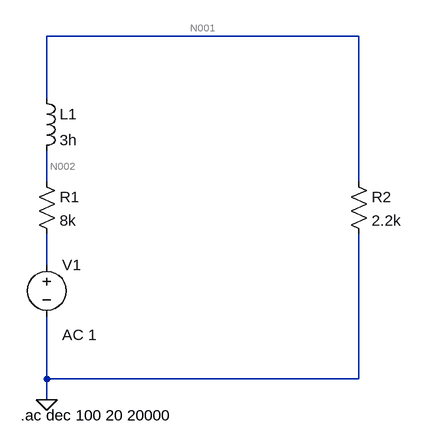
[diagram p0: schematic Direct.asc]
Direct.asc, the LTspice schematic file:
Version 4.1
SHEET 1 880 680
WIRE 608 -208 128 -208
WIRE 128 -112 128 -208
WIRE 128 16 128 -32
WIRE 608 16 608 -208
WIRE 128 144 128 96
WIRE 128 320 128 224
WIRE 608 320 608 96
WIRE 608 320 128 320
WIRE 128 352 128 320
FLAG 128 352 0
SYMBOL voltage 128 128 R0
WINDOW 123 24 124 Left 2
WINDOW 39 0 0 Left 0
SYMATTR InstName V1
SYMATTR Value ""
SYMATTR Value2 AC 1
SYMBOL res 112 0 R0
SYMATTR InstName R1
SYMATTR Value 8k
SYMBOL ind 112 -128 R0
SYMATTR InstName L1
SYMATTR Value 3h
SYMBOL res 592 0 R0
SYMATTR InstName R2
SYMATTR Value 2.2k
TEXT 88 376 Left 2 !.ac dec 100 20 20000

The netlist it stands for:
* Direct.asc
V1 N003 0 AC 1
R1 N002 N003 8k
L1 N001 N002 3h
R2 N001 0 2.2k
.ac dec 100 20 20000
.backanno
.end

* Results of the author's LTspice run, read from the files saved beside the schematic
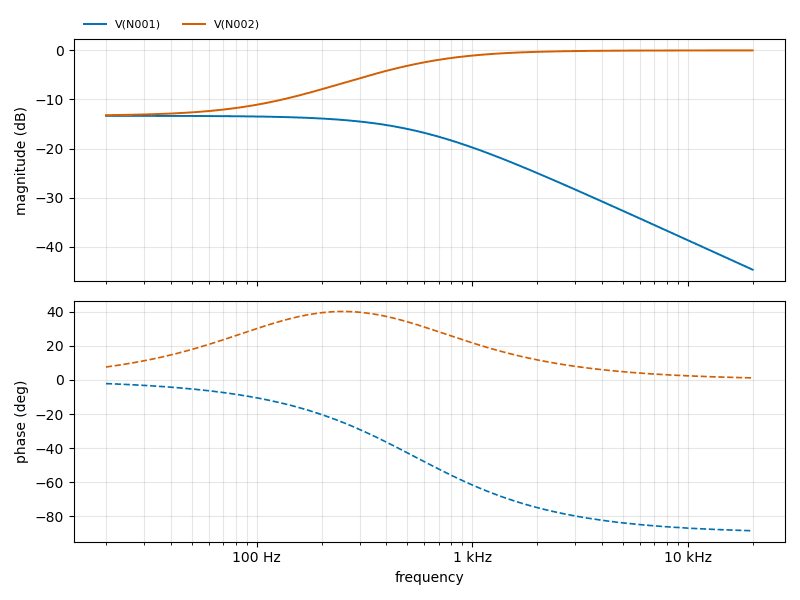
[diagram p1: AC Analysis of Direct.asc, plotted from the saved traces]
* AC Analysis, 1 run:
*   V(N001): -13.33 dB at 20 Hz, -44.68 dB at 20 kHz, peak -13.33 dB at 20 Hz, 3 dB below the peak at 541.8 Hz
*   V(N002): -13.20 dB at 20 Hz, -0.00 dB at 20 kHz, peak -0.00 dB at 20 kHz, 3 dB below the peak at 515 Hz